# Altium schematic sheet CPLD-V INFORMATION.SchDoc
size A; SheetNumber: 1; SheetTotal: 3
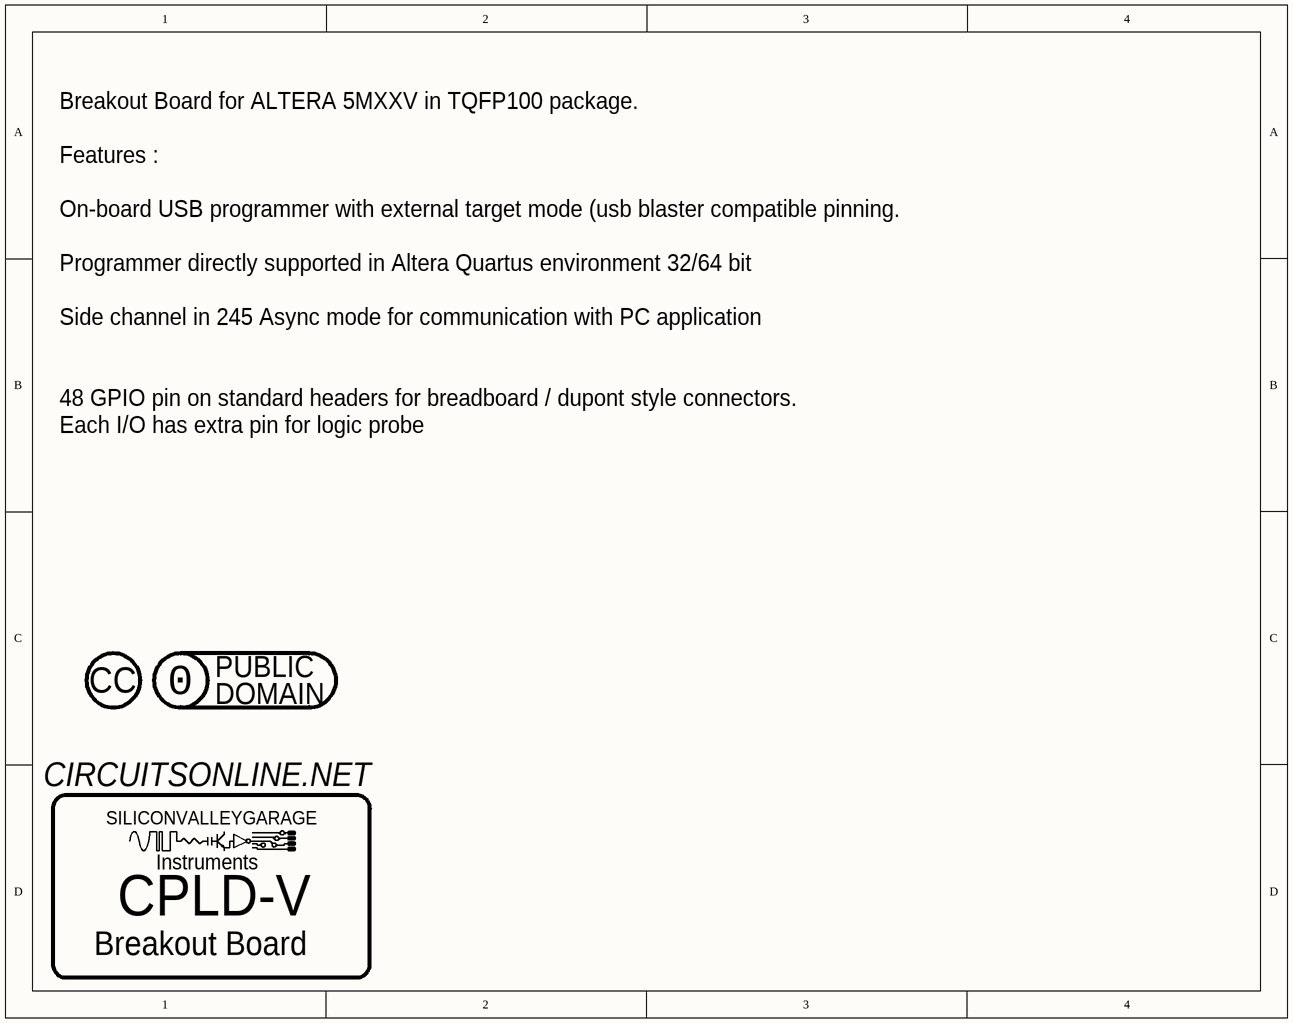
[diagram p0: CPLD-V INFORMATION.SchDoc]

## Parts
LOGO5  LOGO-LICENSE-CC0-PUBLIC  [LOGO-LICENSE-CC0-PUBLIC]  (value not drawn)  (no BOM)
LOGO6  LOGO-LICENSE-CC  [LOGO-LICENSE-CC]  (value not drawn)  (no BOM)
LOGO?  LOGO-SILICONVALLEYGARAGE-SMALL  [SILICONVALLEYGARAGE]  (value not drawn)  (graphical)

## Blocks framed on the sheet
CPLD-V: LOGO?

## Notes on the sheet
- Breakout Board for ALTERA 5MXXV in TQFP100 package.
  Features :
  On-board USB programmer with external target mode (usb blaster compatible pinning.
  Programmer directly supported in Altera Quartus environment 32/64 bit
  Side channel in 245 Async mode for communication with PC application
  48 GPIO pin on standard headers for breadboard / dupont style connectors.
  Each I/O has extra pin for logic probe
- (near LOGO?) CIRCUITSONLINE.NET
- (near LOGO?) Instruments
- Breakout Board
- (in symbol LOGO-LICENSE-CC) CC
- (in symbol LOGO-LICENSE-CC0-PUBLIC) PUBLIC; 0; DOMAIN
- (in symbol LOGO-SILICONVALLEYGARAGE-SMALL) SILICONVALLEYGARAGE

## Library data of the parts
LOGO? = LOGO-SILICONVALLEYGARAGE-SMALL: LOGO,SILICONVALLEYGARAGE,SMALL